# Altium project TH8_Cryo_TC_Breakouts.PrjPCB
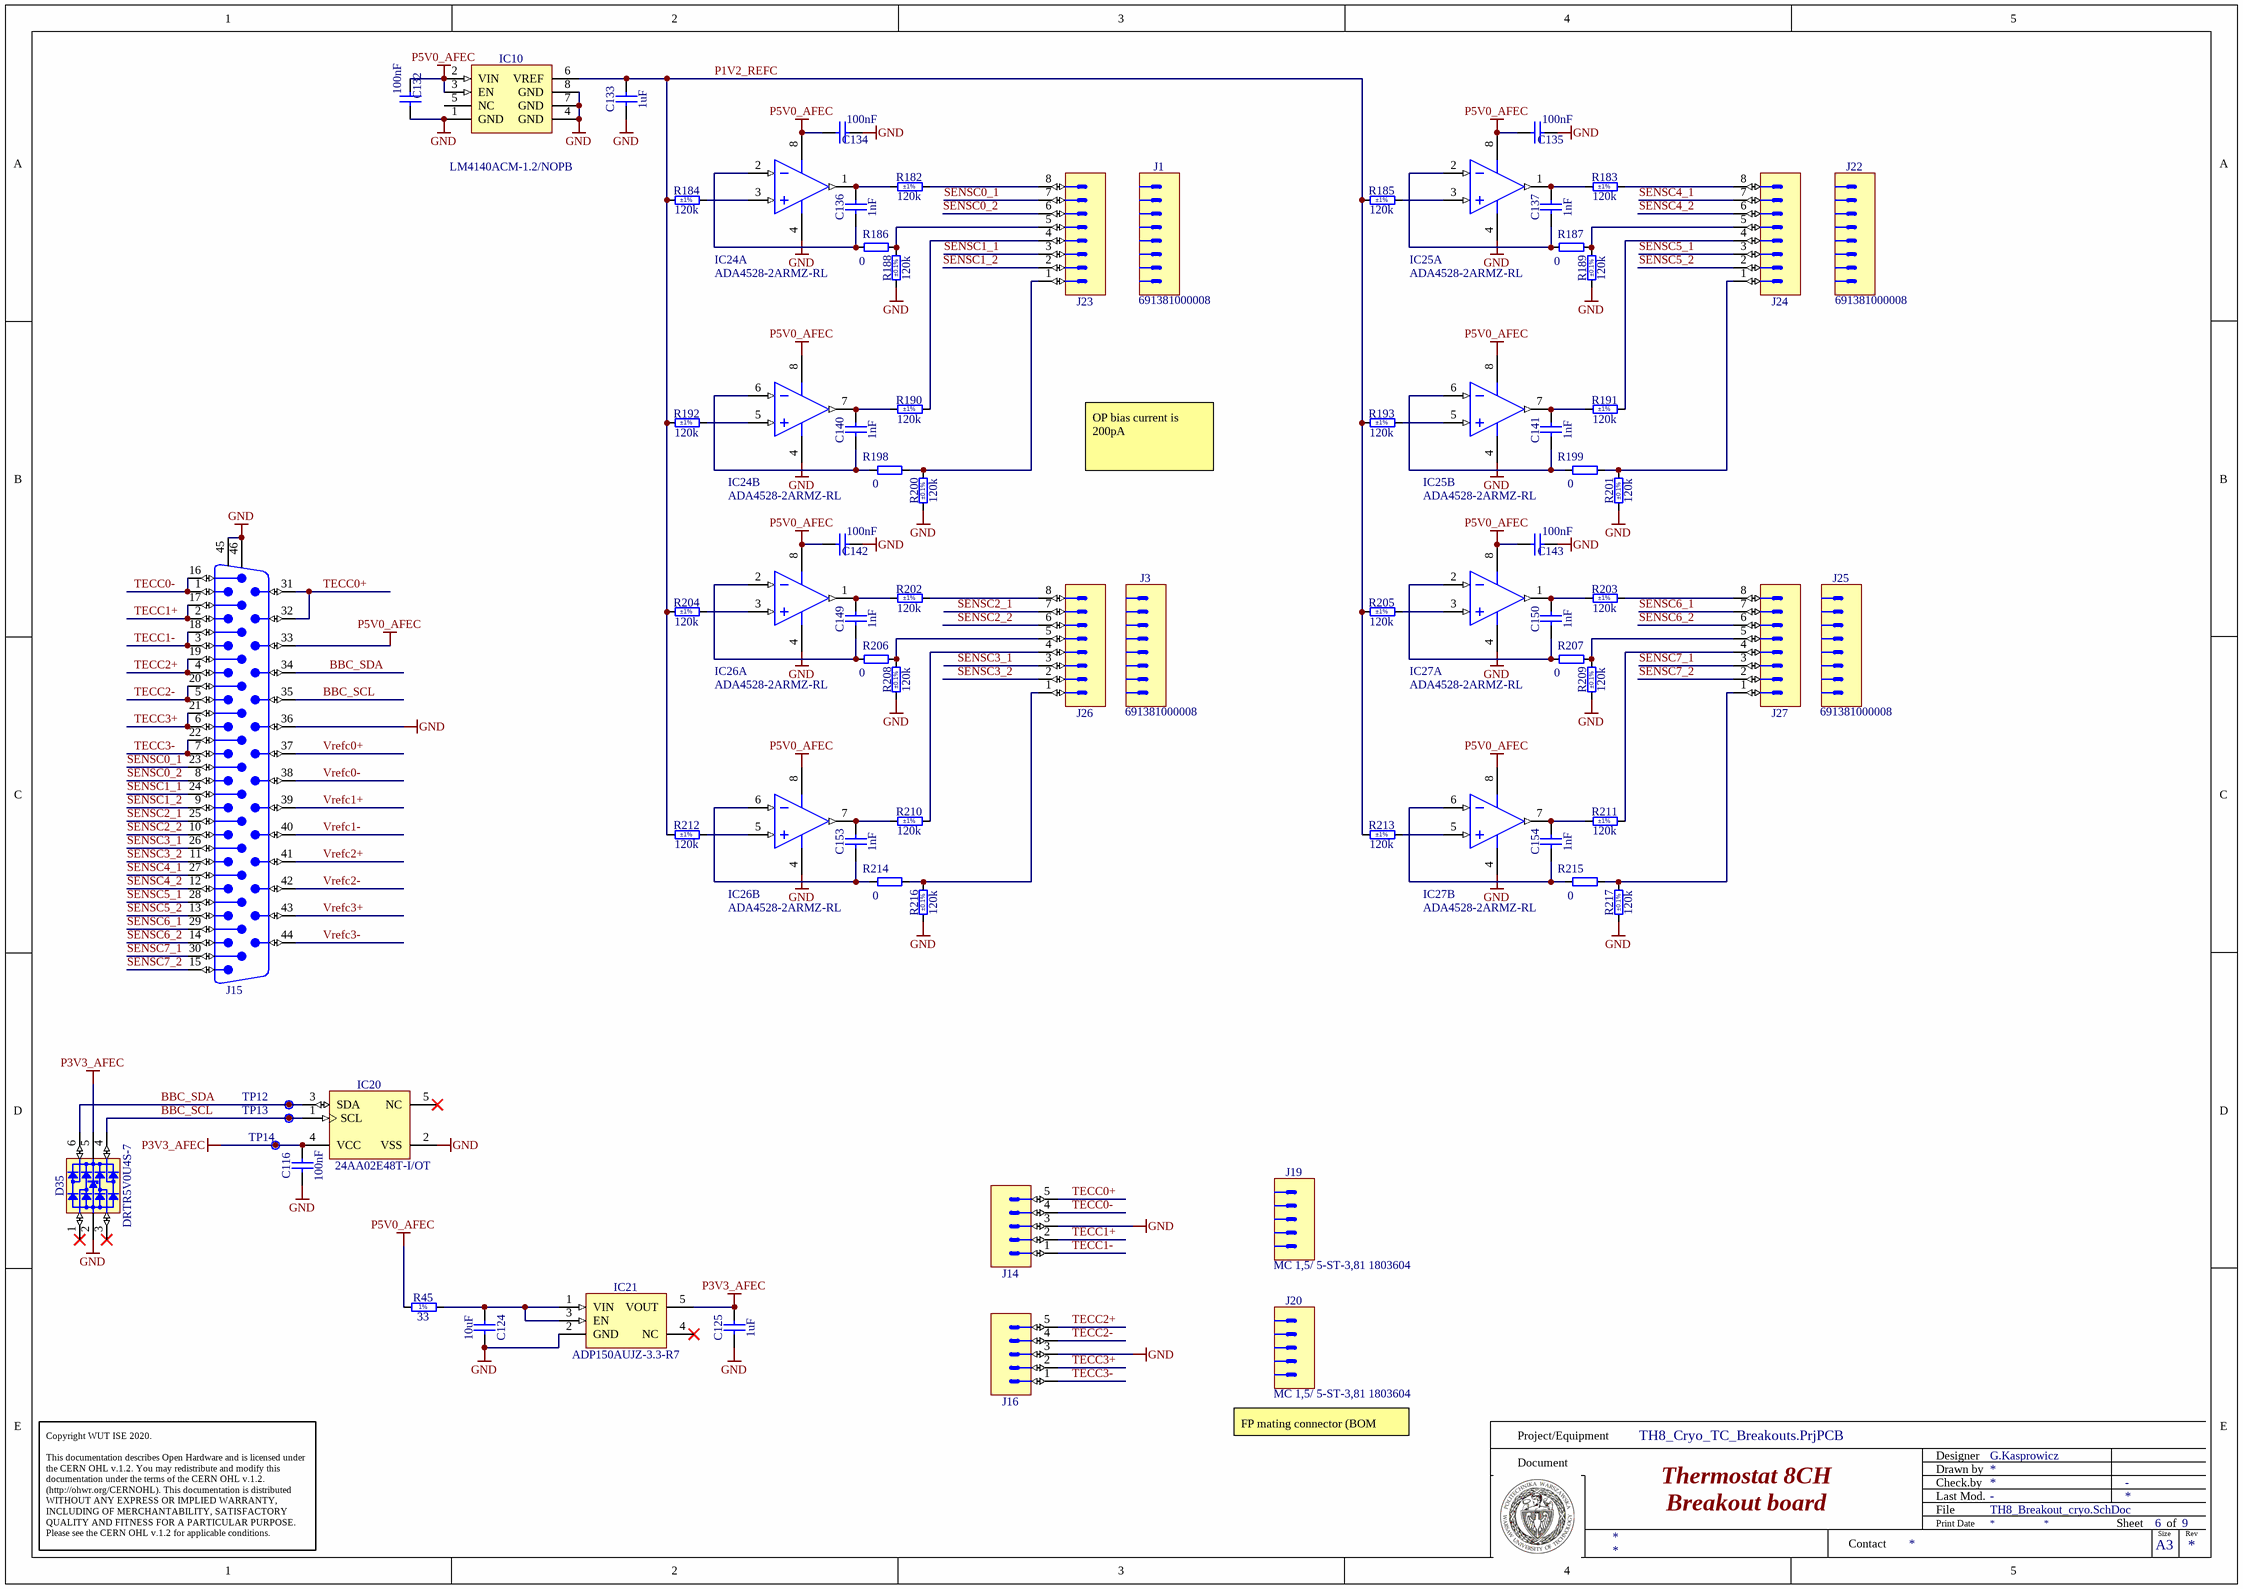
[diagram p0: TH8_Breakout_cryo.SchDoc]
2 sheets, 129 parts. Net scope: global (net labels, ports and power ports of the same name join across sheets).
Board file: TH8_Cryo_TC_Breakouts.PCBDOC
Sheets:
  TH8_Breakout_cryo.SchDoc
  TH8_Breakout.SchDoc

## Sheet TH8_Breakout_cryo.SchDoc: Thermostat 8CH
size 420 x 297 mm; DocumentNumber: 6; SheetNumber: 6; SheetTotal: 9; ModifiedBy: -; CheckedDate: -; Title2: Breakout board; DivGrp: WUT ISE; Designer: G.Kasprowicz

### Parts
C116  100nF  [CAPC1005X55N]
C124  10uF  [CAPC2012X135N]
C125  1uF  [CAPC1608X87N]
C132  100nF  [CAPC1005X55N]
C133  1uF  [CAPC1608X87N]
C134  100nF  [CAPC1005X55N]
C135  100nF  [CAPC1005X55N]
C136  1nF  [CAPC1005X55N]
C137  1nF  [CAPC1005X55N]
C140  1nF  [CAPC1005X55N]
C141  1nF  [CAPC1005X55N]
C142  100nF  [CAPC1005X55N]
C143  100nF  [CAPC1005X55N]
C149  1nF  [CAPC1005X55N]
C150  1nF  [CAPC1005X55N]
C153  1nF  [CAPC1005X55N]
C154  1nF  [CAPC1005X55N]
D35  DRTR5V0U4S-7  [SOT65P210X110-6N]
IC10  LM4140ACM-1.2/NOPB  [SOIC127P600X175-8N]
IC20  24AA02E48T-I/OT  [SOT95P280X145-5N]
IC21  ADP150AUJZ-3.3-R7  [SOT95P280X90-5N]
IC24  ADA4528-2ARMZ-RL  [ADI-RM-8_N]  (parts A,B of 2)
IC25  ADA4528-2ARMZ-RL  [ADI-RM-8_N]  (parts A,B of 2)
IC26  ADA4528-2ARMZ-RL  [ADI-RM-8_N]  (parts A,B of 2)
IC27  ADA4528-2ARMZ-RL  [ADI-RM-8_N]  (parts A,B of 2)
J1  691381000008  [WURTH_691381000008]
J3  691381000008  [WURTH_691381000008]
J14  (no value)  [PHOENIX_1803455]
J15  D-Sub  [AMPHENOL_10090926-P444XLF]  (value not drawn)
J16  (no value)  [PHOENIX_1803455]
J19  Manufacturer Part Number: MC 1,5/ 5-ST-3,81 1803604  [PHOENIX_1803604]
J20  Manufacturer Part Number: MC 1,5/ 5-ST-3,81 1803604  [PHOENIX_1803604]
J22  691381000008  [WURTH_691381000008]
J23  (no value)  [PHOENIX_1881613]
J24  (no value)  [PHOENIX_1881613]
J25  691381000008  [WURTH_691381000008]
J26  (no value)  [PHOENIX_1881613]
J27  (no value)  [PHOENIX_1881613]
R45  33  [RESC1005X40N]
R182  120k  Tolerance: ±1%  [RESC1005X40N]
R183  120k  Tolerance: ±1%  [RESC1005X40N]
R184  120k  Tolerance: ±1%  [RESC1005X40N]
R185  120k  Tolerance: ±1%  [RESC1005X40N]
R186  0  [RESC1608X55N]
R187  0  [RESC1608X55N]
R188  120k  Tolerance: ±0.1%  [RESC2012X60N]
R189  120k  Tolerance: ±0.1%  [RESC2012X60N]
R190  120k  Tolerance: ±1%  [RESC1005X40N]
R191  120k  Tolerance: ±1%  [RESC1005X40N]
R192  120k  Tolerance: ±1%  [RESC1005X40N]
R193  120k  Tolerance: ±1%  [RESC1005X40N]
R198  0  [RESC1608X55N]
R199  0  [RESC1608X55N]
R200  120k  Tolerance: ±0.1%  [RESC2012X60N]
R201  120k  Tolerance: ±0.1%  [RESC2012X60N]
R202  120k  Tolerance: ±1%  [RESC1005X40N]
R203  120k  Tolerance: ±1%  [RESC1005X40N]
R204  120k  Tolerance: ±1%  [RESC1005X40N]
R205  120k  Tolerance: ±1%  [RESC1005X40N]
R206  0  [RESC1608X55N]
R207  0  [RESC1608X55N]
R208  120k  Tolerance: ±0.1%  [RESC2012X60N]
R209  120k  Tolerance: ±0.1%  [RESC2012X60N]
R210  120k  Tolerance: ±1%  [RESC1005X40N]
R211  120k  Tolerance: ±1%  [RESC1005X40N]
R212  120k  Tolerance: ±1%  [RESC1005X40N]
R213  120k  Tolerance: ±1%  [RESC1005X40N]
R214  0  [RESC1608X55N]
R215  0  [RESC1608X55N]
R216  120k  Tolerance: ±0.1%  [RESC2012X60N]
R217  120k  Tolerance: ±0.1%  [RESC2012X60N]
TP12  Test Point  [TPS127]  (value not drawn)
TP13  Test Point  [TPS127]  (value not drawn)
TP14  Test Point  [TPS127]  (value not drawn)

### Nets
GND: C116.1 C124.2 C125.1 C132.2 C133.1 C134.1 C135.1 C142.1 C143.1 D35.2(GND) IC10.1(GND) IC10.4(GND) IC10.7(GND) IC10.8(GND) IC20.2(VSS) IC21.2(GND) IC24.4(-V) IC25.4(-V) IC26.4(-V) IC27.4(-V) J14.3 J15.36 J15.45 J15.46 J16.3 R188.1 R189.1 R200.1 R201.1 R208.1 R209.1 R216.1 R217.1
P3V3_AFEC: C116.2 C125.2 D35.5(VBUS) IC20.4(VCC) IC21.5(VOUT) TP14.1
P5V0_AFEC: C132.1 C134.2 C135.2 C142.2 C143.2 IC10.2(VIN) IC10.3(EN) IC24.8(+V) IC25.8(+V) IC26.8(+V) IC27.8(+V) J15.33 R45.1
BBC_SCL: D35.4(I/O3) IC20.1(SCL) J15.35 TP13.1
BBC_SDA: D35.6(I/O4) IC20.3(SDA) J15.34 TP12.1
P1V2_REFC: C133.2 IC10.6(VREF) R184.1 R185.1 R192.1 R193.1 R204.1 R205.1 R212.1 R213.1
SENSC0_1: J15.23 J23.7
SENSC0_2: J15.8 J23.6
SENSC1_1: J15.24 J23.3
SENSC1_2: J15.9 J23.2
SENSC2_1: J15.25 J26.7
SENSC2_2: J15.10 J26.6
SENSC3_1: J15.26 J26.3
SENSC3_2: J15.11 J26.2
SENSC4_1: J15.27 J24.7
SENSC4_2: J15.12 J24.6
SENSC5_1: J15.28 J24.3
SENSC5_2: J15.13 J24.2
SENSC6_1: J15.29 J27.7
SENSC6_2: J15.14 J27.6
SENSC7_1: J15.30 J27.3
SENSC7_2: J15.15 J27.2
TECC0+: J14.5 J15.31 J15.32
TECC0-: J14.4 J15.1 J15.16
TECC1+: J14.2 J15.2 J15.17
TECC1-: J14.1 J15.3 J15.18
TECC2+: J15.4 J15.19 J16.5
TECC2-: J15.5 J15.20 J16.4
TECC3+: J15.6 J15.21 J16.2
TECC3-: J15.7 J15.22 J16.1
Vrefc0+: J15.37
Vrefc0-: J15.38
Vrefc1+: J15.39
Vrefc1-: J15.40
Vrefc2+: J15.41
Vrefc2-: J15.42
Vrefc3+: J15.43
Vrefc3-: J15.44
NetC124_1: C124.1 IC21.1(VIN) IC21.3(EN) R45.2
NetC136_1: C136.1 IC24.2(-IN_A) R186.2
NetC136_2: C136.2 IC24.1(OUT_A) R182.1
NetC137_1: C137.1 IC25.2(-IN_A) R187.2
NetC137_2: C137.2 IC25.1(OUT_A) R183.1
NetC140_1: C140.1 IC24.6(-IN_B) R198.2
NetC140_2: C140.2 IC24.7(OUT_B) R190.1
NetC141_1: C141.1 IC25.6(-IN_B) R199.2
NetC141_2: C141.2 IC25.7(OUT_B) R191.1
NetC149_1: C149.1 IC26.2(-IN_A) R206.2
NetC149_2: C149.2 IC26.1(OUT_A) R202.1
NetC150_1: C150.1 IC27.2(-IN_A) R207.2
NetC150_2: C150.2 IC27.1(OUT_A) R203.1
NetC153_1: C153.1 IC26.6(-IN_B) R214.2
NetC153_2: C153.2 IC26.7(OUT_B) R210.1
NetC154_1: C154.1 IC27.6(-IN_B) R215.2
NetC154_2: C154.2 IC27.7(OUT_B) R211.1
NetIC24_3: IC24.3(+IN_A) R184.2
NetIC24_5: IC24.5(+IN_B) R192.2
NetIC25_3: IC25.3(+IN_A) R185.2
NetIC25_5: IC25.5(+IN_B) R193.2
NetIC26_3: IC26.3(+IN_A) R204.2
NetIC26_5: IC26.5(+IN_B) R212.2
NetIC27_3: IC27.3(+IN_A) R205.2
NetIC27_5: IC27.5(+IN_B) R213.2
NetJ23_1: J23.1 R198.1 R200.2
NetJ23_4: J23.4 R190.2
NetJ23_5: J23.5 R186.1 R188.2
NetJ23_8: J23.8 R182.2
NetJ24_1: J24.1 R199.1 R201.2
NetJ24_4: J24.4 R191.2
NetJ24_5: J24.5 R187.1 R189.2
NetJ24_8: J24.8 R183.2
NetJ26_1: J26.1 R214.1 R216.2
NetJ26_4: J26.4 R210.2
NetJ26_5: J26.5 R206.1 R208.2
NetJ26_8: J26.8 R202.2
NetJ27_1: J27.1 R215.1 R217.2
NetJ27_4: J27.4 R211.2
NetJ27_5: J27.5 R207.1 R209.2
NetJ27_8: J27.8 R203.2

Not connected (* = marked no-connect by the designer): D35 1(I/O1)* 3(I/O2)*; IC10 5(NC); IC20 5(NC)*; IC21 4(NC)*

### Notes on the sheet
- OP bias current is 200pA
- FP mating connector (BOM only)
- Project/Equipment
- Document
- Designer
- Drawn by
- Check.by
- Copyright WUT ISE 2020.
  This documentation describes Open Hardware and is licensed under the CERN OHL v.1.2. You may redistribute and modify this documentation under the terms of the CERN OHL v.1.2. (http://ohwr.org/CERNOHL). This documentation is distributed WITHOUT ANY EXPRESS OR IMPLIED WARRANTY, INCLUDING OF MERCHANTABILITY, SATISFACTORY QUALITY AND FITNESS FOR A PARTICULAR PURPOSE. Please see the CERN OHL v.1.2 for applicable conditions.
- Contact
- File
- Last Mod.
- Print Date
- Sheet
- Size
- A3
- of
- Rev
- (in symbol R0402_33R_1%_0.0625W_100PPM) 1%

### Library data of the parts
C116 C132 C134 C135 C142 C143 = CC0402_100NF_16V_10%_X5R: Non-polarised capacitor; Part Description: SMD Multilayer Chip Ceramic Capacitor; Manufacturer: GENERIC; Manufacturer1 Part Number: GRM155R61C104KA88D; Voltage: 16V; TC: X5R; Tolerance: ±10%; Part Number: CC0402_100NF_16V_10%_X5R; Component Kind: Standard; Component Type: Standard; Pin Count: 2; Value: 100nF; Status: None; Manufacturer Part Number: CC0402_100NF_16V_10%_X5R; Case: 0402; Mounted: Yes; Socket: No; SMD: Yes; Sense: No; Manufacturer1 Example: MURATA; Manufacturer1 ComponentHeight: 0.55mm; HelpURL: \\cern.ch\dfs\Applications\Altium\Datasheets\CC0402_X5R_MURATA_GRM.pdf; Author: CERN DEM JLC; CreateDate: 10.12.2013; LatestRevisionDate: 10.12.2013
C124 = CC0805_10UF_16V_10%_X5R: Non-polarised capacitor; Part Description: SMD Multilayer Chip Ceramic Capacitor; Manufacturer: GENERIC; Manufacturer1 Part Number: C0805C106K4PAC; Voltage: 16V; TC: X5R; Tolerance: ±10%; Part Number: CC0805_10UF_16V_10%_X5R; Component Kind: Standard; Component Type: Standard; Pin Count: 2; Value: 10uF; Status: Preferred; Manufacturer Part Number: CC0805_10UF_16V_10%_X5R; Case: 0805; Mounted: Yes; Socket: No; SMD: Yes; Manufacturer1 Example: KEMET; Manufacturer1 ComponentHeight: 1.4mm; HelpURL: \\cern.ch\dfs\Applications\Altium\Datasheets\CC1206_X5R_KEMET.pdf; Author: CERN DEM JLC; CreateDate: 03.12.2007; LatestRevisionDate: 03.12.2007; Sense: No
C125 C133 = CC0603_1UF_25V_10%_X7R: Non-polarised capacitor; Part Description: SMD Multilayer Chip Ceramic Capacitor; Manufacturer: GENERIC; Manufacturer1 Part Number: GRM188R71E105KA12D; Voltage: 25V; TC: X7R; Tolerance: ±10%; Part Number: CC0603_1UF_25V_10%_X7R; Component Kind: Standard; Component Type: Standard; Pin Count: 2; Value: 1uF; Status: None; Manufacturer Part Number: CC0603_1UF_25V_10%_X7R; Case: 0603; Mounted: Yes; Socket: No; SMD: Yes; Sense: No; Manufacturer1 Example: MURATA; Manufacturer1 ComponentHeight: 0.9mm; HelpURL: \\cern.ch\dfs\Applications\Altium\Datasheets\CC0603_X7R_MURATA.pdf; Author: CERN DEM JLC; CreateDate: 18/01/2011; LatestRevisionDate: 18/01/2011
C136 C137 C140 C141 C149 C150 C153 C154 = CC0402_1NF_50V_10%_X7R: Non-polarised capacitor; Part Description: SMD Multilayer Chip Ceramic Capacitor; Manufacturer: GENERIC; Manufacturer1 Part Number: 223858715623; Voltage: 50V; TC: X7R; Tolerance: ±10%; Part Number: CC0402_1NF_50V_10%_X7R; Component Kind: Standard; Component Type: Standard; Pin Count: 2; Value: 1nF; Status: Not Recommended; Manufacturer Part Number: CC0402_1NF_50V_10%_X7R; Case: 0402; Mounted: Yes; Socket: No; SMD: Yes; Sense: No; Manufacturer1 Example: PHYCOMP; Manufacturer1 ComponentHeight: 0.55mm; HelpURL: \\cern.ch\dfs\Applications\Altium\Datasheets\CC0402_X7R_PHYCOMP.pdf; Author: CERN DEM JLC; CreateDate: 03/12/2007; LatestRevisionDate: 03/12/2007
D35 = D_TVS_DRTR5V0U4S-7: Integrated Quad Ultra-Low Capacitance ESD Protection; Part Description: Integrated Quad Ultra-Low Capacitance ESD (±8kV) Protection; Manufacturer: DIODES; PressFit: No; Bonding: No; Status Comment: Active; Part Number: DRTR5V0U4S-7; Component Kind: Standard; Component Type: Standard; Device: DRTR5V0U4S-7; PackageDescription: SOT363, SC70-6, 0.65mm Pitch; 6 Pin, 1.25mm W X 2.00mm L X 1.10mm H body, IPC Medium Density; Status: Active; Manufacturer Part Number: DRTR5V0U4S-7; Pin Count: 6; Case: SOT363; Mounted: Yes; Socket: No; SMD: Yes; Sense: No; ComponentHeight: 1.1mm; HelpURL: \\cern.ch\dfs\Applications\Altium\Datasheets\PRTR5V0U4Y.pdf; Author: GK; CreateDate: 24.01.2017; LatestRevisionDate: 14.09.2020
IC10 = LM4140ACM-1.2/NOPB: High Precision Low Noise Low Dropout Voltage Reference; Part Description: 1.2V 0.1% 3 ppm/°C, High Precision Low Noise Low Dropout Voltage Reference; Manufacturer: TEXAS INSTRUMENTS; PressFit: No; Bonding: No; Part Number: LM4140ACM-1.2/NOPB; Component Kind: Standard; Component Type: Standard; Device: LM4140ACM-1.2/NOPB; PackageDescription: SOIC 8, Pitch 1.27mm, Body 4x5mm, IPC Medium Density; Manufacturer Part Number: LM4140ACM-1.2/NOPB; Pin Count: 8; Case: SOIC8; Mounted: Yes; Socket: No; SMD: Yes; Sense: No; ComponentHeight: 1.75mm; HelpURL: \\cern.ch\dfs\Applications\Altium\Datasheets\LM4140ACM-1.2-NOPB.pdf; Author: CERN DEM JLC; CreateDate: 17.11.2014; LatestRevisionDate: 17.11.2014
IC20 = 24AA02E48T-I/OT: 1.7V-5.5V, 2K I2C Serial EEPROM With EUI-48 Node Identity; Manufacturer: MICROCHIP TECHNOLOGY; PressFit: No; Bonding: No; Part Number: 24AA02E48T-I/OT; Component Kind: Standard; Component Type: Standard; Device: 24AA02E48T-I/OT; PackageDescription: SOT, 0.95mm pitch; 5 pin, 1.60mm W X 2.90mm L X 1.45mm H body, IPC Medium Density; Part Description: 1.7V-5.5V, 2K I2C Serial EEPROM With EUI-48 Node Identity; Manufacturer Part Number: 24AA02E48T-I/OT; Pin Count: 5; Case: SOT23-5; Mounted: Yes; Socket: No; SMD: Yes; Sense: No; ComponentHeight: 1.45mm; HelpURL: \\cern.ch\dfs\Applications\Altium\Datasheets\24AA02E48T-I-OT.pdf; Author: CERN DEM MR; CreateDate: 31.03.2016; LatestRevisionDate: 31.03.2016
IC21 = ADP150AUJZ-3.3-R7: Ultralow Noise, 150 mA CMOS Linear Regulator; Part Description: 3.3V, 150mA, Ultralow Noise, CMOS Linear Regulator; Manufacturer: ANALOG DEVICES; PressFit: No; Bonding: No; Part Number: ADP150AUJZ-3.3-R7; Component Kind: Standard; Component Type: Standard; Device: ADP150AUJZ-3.3-R7; PackageDescription: SOT23, 0.95mm pitch; 5 pin, 1.75mm W X 3.00mm L, IPC Medium Density; Manufacturer Part Number: ADP150AUJZ-3.3-R7; Pin Count: 5; Case: SOT23; Mounted: Yes; Socket: No; SMD: Yes; Sense: No; ComponentHeight: 0.9mm; HelpURL: \\cern.ch\dfs\Applications\Altium\Datasheets\ADP150AUJZ-3.3-R7.pdf; Author: CERN DEM JLC; CreateDate: 27/09/2011; LatestRevisionDate: 19/06/2014
IC24-IC27 = CMP-0384-01794-1: Double Channel RRIO Operational Amplifier, 3.4 MHz BW, 500 mV/us SR, Industrial, 8-pin SOP (RM-8), Reel; Manufacturer: Analog Devices; V Span Max: 5.5V; Iq/Amp: 1.5mA; Amplifiers Per Package: 2; Input Bias Current: 125pA; V Span Min: 2.2V; Small Signal Bandwidth: 3.4MHz; Input Offset Voltage: 300nV; Code_JEDEC: MO-187-AA; PackageReference: RM-8; ComponentLink3Description: Package Specification; Slew Rate: 500mV/us; PartNumber: ADA4528-2ARMZ-RL; ComponentLink2Description: Datasheet; Generic Part Number: ADA4528-2; DatasheetVersion: Rev. C; ComponentLink1URL: http://www.analog.com/en/index.html; Packing: Reel; ComponentLink3URL: http://www.analog.com/static/imported-files/packages/PKG_PDF/MSOP%28RM%29/RM_8.pdf; PackageDescription: 8-Pin Mini Small Outline Package, Body 3 x 3 mm, Pitch 0.65 mm; ComponentLink2URL: http://www.analog.com/static/imported-files/data_sheets/ADA4528-1_4528-2.pdf; ComponentLink1Description: Manufacturer URL; Mounting Technology: Surface Mount
J1 J3 J22 J25 = CON_TB_WURTH_691381000008: Phoenix Contact 2.5 pitch terminal plug, 8 ways; Manufacturer: WURTH; Manufacturer Part Number: 691381000008
J14 J16 = PHOENIX_1803455: Connector 5 Male; Part Description: 8A 160 V, Pitch: 3.81mm, 5 Positions Header; Manufacturer: PHOENIX CONTACT; Manufacturer Part Number: 1803455 (MCV 1,5/ 5-G-3,81); PressFit: No; Part Number: PHOENIX_1803455; Component Kind: Standard; Component Type: Standard; Pin Count: 5; Mounted: Yes; Socket: No; SMD: No; Sense: No; Status: None; ComponentHeight: 9.2mm; HelpURL: \\cern.ch\dfs\Applications\Altium\Datasheets\PHOENIX_1803455.pdf; Author: CERN DEM JLC; CreateDate: 04.11.2013; LatestRevisionDate: 04.11.2013
J15 = AMPHENOL_10090926-P444XLF: Connector D-sub 44 Male; Part Description: Right Angle High Density D-sub 44 Male Contacts with Harpoons + UNC 4-40 Clinchnuts + Electrical Continuity; PressFit: No; Part Number: AMPHENOL_10090926-P444XLF; Component Kind: Standard; Component Type: Standard; Pin Count: 46; Family: D-Sub; Mounted: Yes; Socket: No; SMD: No; Sense: No; Status: None; Manufacturer: AMPHENOL; Manufacturer Part Number: 10090926-P444XLF; ComponentHeight: 12.8mm; HelpURL: \\cern.ch\dfs\Applications\Altium\Datasheets\AMPHENOL_10090926-P444XLF.pdf; Author: CERN DEM BC; CreateDate: 22.10.2020; LatestRevisionDate: 22.10.2020
J19 J20 = PHOENIX_1803604: Phoenix Contact 3.81 pitch terminal plug, 5 ways; Mates with: PHOENIX_1803303; Manufacturer: Phoenix Contact
J23 J24 J26 J27 = PHOENIX_1881613: Connector 8 Male; Part Description: 4A, 160V, MICRO COMBICON PCB Header, Pitch 2.5mm, 8 Positions; Manufacturer: PHOENIX CONTACT; Manufacturer Part Number: 1881613 (MCV 0,5/ 8-G-2,5); PressFit: No; Part Number: PHOENIX_1881613; Component Kind: Standard; Component Type: Standard; Pin Count: 8; Mounted: Yes; Socket: No; SMD: No; Sense: No; Status: None; ComponentHeight: 10.1mm; HelpURL: \\cern.ch\dfs\Applications\Altium\Datasheets\PHOENIX_1881613.pdf; Author: CERN DEM JLC; CreateDate: 03.11.2009; LatestRevisionDate: 10.02.2011
R45 = R0402_33R_1%_0.0625W_100PPM: Resistor - 1%; Part Description: General Purpose Thick Film Chip Resistor; Manufacturer: GENERIC; Manufacturer1 Part Number: 232270673309L; TC: ±100ppm/°C; PressFit: No; Part Number: R0402_33R_1%_0.0625W_100PPM; Component Kind: Standard; Component Type: Standard; Pin Count: 2; Value: 33; Status: Not Recommended; Power: 0.0625W; Tolerance: ±1%; Manufacturer Part Number: R0402_33R_1%_0.0625W_100PPM; Case: 0402; Mounted: Yes; Sense: No; Socket: No; SMD: Yes; Manufacturer1 Example: YAGEO PHYCOMP; Manufacturer1 ComponentHeight: 0.4mm; HelpURL: \\cern.ch\dfs\Applications\Altium\Datasheets\R0402_Phycomp_RC0402.pdf; Author: CERN DEM JLC; CreateDate: 03/12/2007; LatestRevisionDate: 17/10/2012
R182-R185 R190-R193 R202-R205 R210-R213 = R0402_120K_1%_0.0625W_100PPM: Resistor - 1%; Part Description: General Purpose Thick Film Chip Resistor; Manufacturer: GENERIC; Manufacturer1 Part Number: 232270671204L; TC: ±100ppm/°C; PressFit: No; Part Number: R0402_120K_1%_0.0625W_100PPM; Component Kind: Standard; Component Type: Standard; Pin Count: 2; Value: 120k; Status: Not Recommended; Power: 0.0625W; Manufacturer Part Number: R0402_120K_1%_0.0625W_100PPM; Case: 0402; Mounted: Yes; Sense: No; Socket: No; SMD: Yes; Manufacturer1 Example: YAGEO PHYCOMP; Manufacturer1 ComponentHeight: 0.4mm; HelpURL: \\cern.ch\dfs\Applications\Altium\Datasheets\R0402_Phycomp_RC0402.pdf; Author: CERN DEM JLC; CreateDate: 03.12.2007; LatestRevisionDate: 17.10.2012
R186 R187 R198 R199 R206 R207 R214 R215 = R0603_0R_JUMPER: Resistor; Part Description: 1A (0.05R Max DC Resistance) Zero Ohm Jumper; Manufacturer: GENERIC; Manufacturer1 Part Number: NRC06Z0; PressFit: No; Part Number: R0603_0R_JUMPER; Component Kind: Standard; Component Type: Standard; Pin Count: 2; Value: 0; Status: Preferred; Manufacturer Part Number: R0603_0R_JUMPER; Case: 0603; Mounted: Yes; Sense: No; Socket: No; SMD: Yes; Manufacturer1 Example: NIC COMPONENT; Manufacturer1 ComponentHeight: 0.55mm; HelpURL: \\cern.ch\dfs\Applications\Altium\Datasheets\R0603_NIC_NRC.pdf; Author: CERN DEM JLC; CreateDate: 03.12.2007; LatestRevisionDate: 13.03.2008
R188 R189 R200 R201 R208 R209 R216 R217 = R0805_120K_0.1%_0.125W_25PPM: Resistor - 0.1%; Part Description: Thin Film Chip Resistor; Manufacturer: GENERIC; Manufacturer1 Part Number: ERA6AEB124V; Power: 0.125W; TC: ±25ppm; PressFit: No; Part Number: R0805_120K_0.1%_0.125W_25PPM; Component Kind: Standard; Component Type: Standard; Pin Count: 2; Value: 120k; Status: Not Recommended; Manufacturer Part Number: R0805_120K_0.1%_0.125W_25PPM; Case: 0805; Mounted: Yes; Sense: No; Socket: No; SMD: Yes; Manufacturer1 Example: PANASONIC; Manufacturer1 ComponentHeight: 0.6mm; HelpURL: \\cern.ch\dfs\Applications\Altium\Datasheets\R0805_PANASONIC_ERA.pdf; Author: CERN DEM JLC; CreateDate: 04.06.2015; LatestRevisionDate: 04.06.2015
TP12-TP14 = SMD_PAD_1.27X1.27MM: Part Description: 1.27mm x 1.27mm PCB Copper Area (SMD Test Point); Mounted: No; Part Number: SMD_PAD_1.27X1.27MM; Component Kind: Standard (No BOM); Component Type: Standard (No BOM); Pin Count: 1; Family: Test Point; Socket: No; SMD: Yes; Sense: No; Status: None; ComponentHeight: 0mm; HelpURL: Undefined; Author: CERN DEM JLC; CreateDate: 12.01.2008; LatestRevisionDate: 12.01.2008; PackageDescription: 1.27mm x 1.27mm PCB Copper Area (SMD Test Point)

## Sheet TH8_Breakout.SchDoc: Thermostat 8CH
size 420 x 297 mm; DocumentNumber: 6; SheetNumber: 6; SheetTotal: 9; ModifiedBy: -; CheckedDate: -; Title2: Breakout board; DivGrp: WUT ISE; Designer: G.Kasprowicz
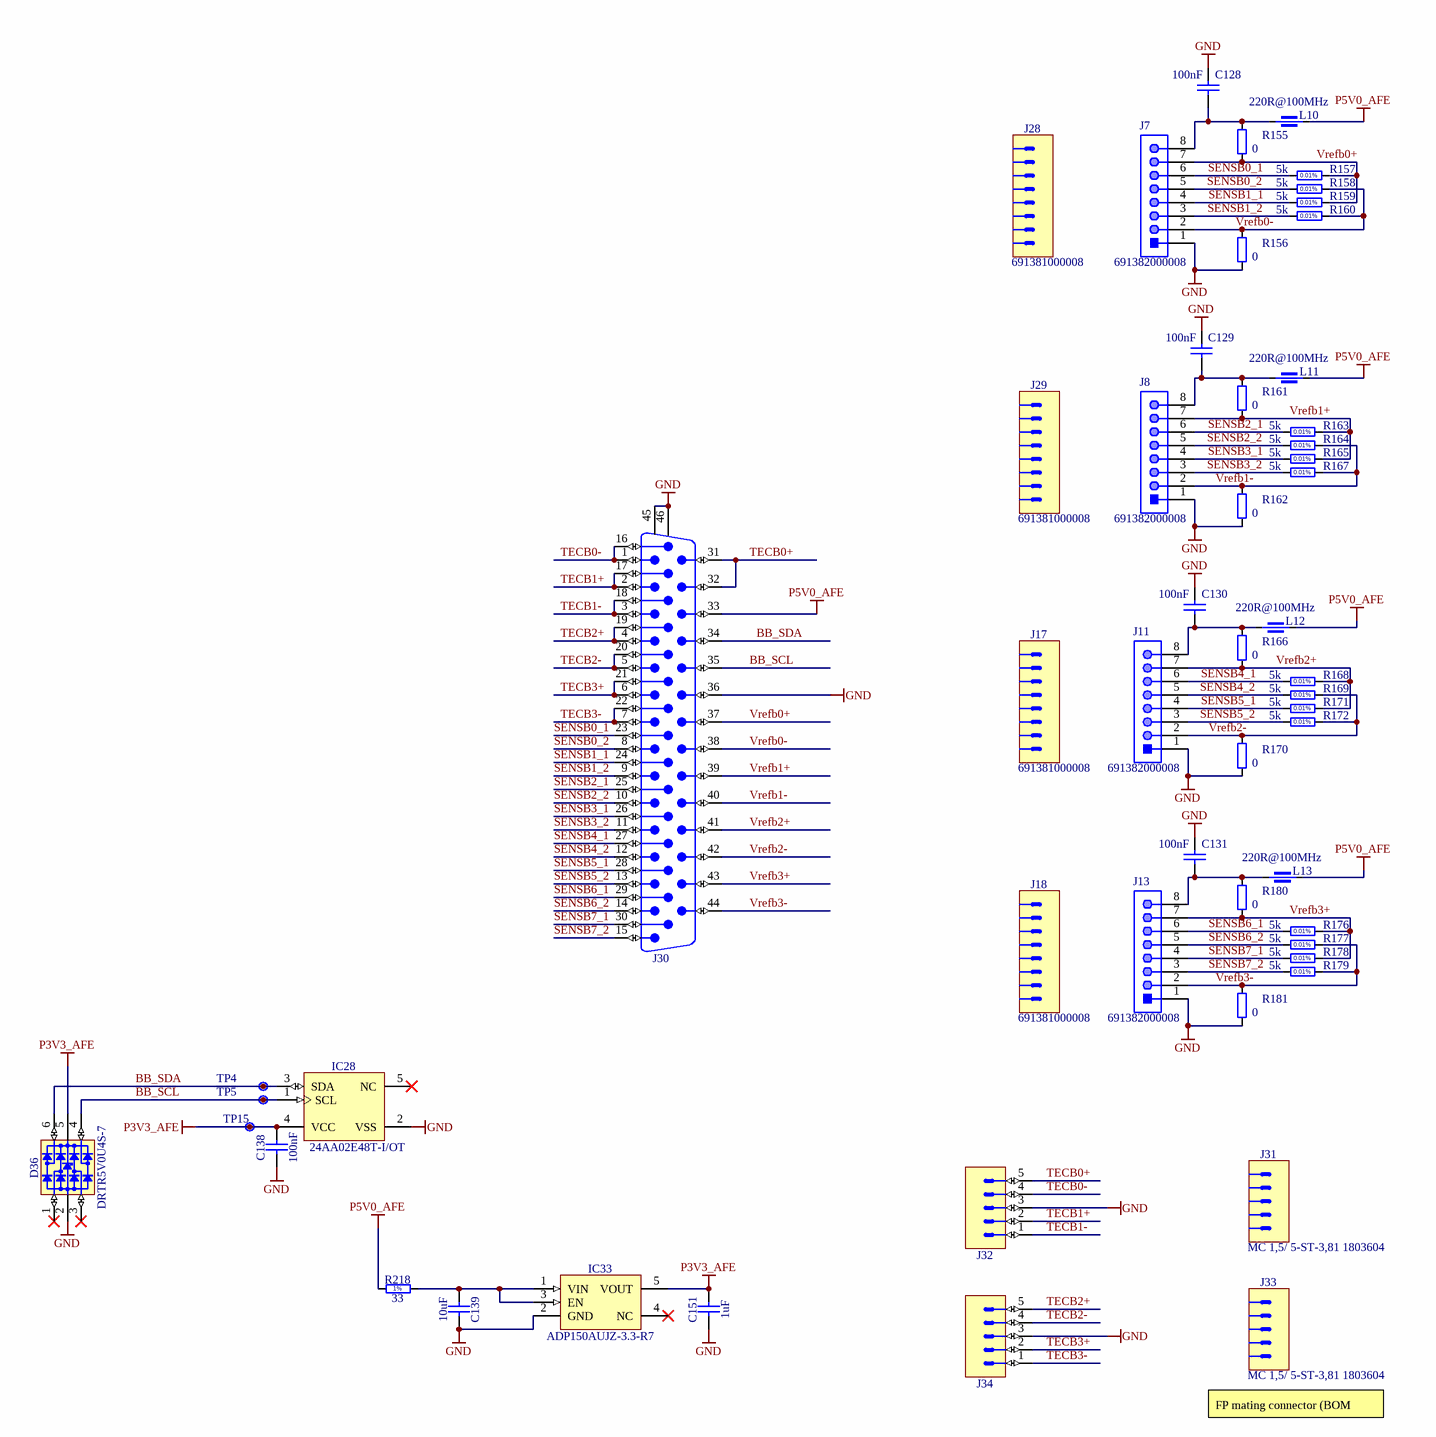
[diagram p1: TH8_Breakout.SchDoc]

### Parts
C128  100nF  [CAPC1005X55N]
C129  100nF  [CAPC1005X55N]
C130  100nF  [CAPC1005X55N]
C131  100nF  [CAPC1005X55N]
C138  100nF  [CAPC1005X55N]
C139  10uF  [CAPC2012X135N]
C151  1uF  [CAPC1608X87N]
D36  DRTR5V0U4S-7  [SOT65P210X110-6N]
IC28  24AA02E48T-I/OT  [SOT95P280X145-5N]
IC33  ADP150AUJZ-3.3-R7  [SOT95P280X90-5N]
J7  691382000008  [691382000008]
J8  691382000008  [691382000008]
J11  691382000008  [691382000008]
J13  691382000008  [691382000008]
J17  691381000008  [WURTH_691381000008]
J18  691381000008  [WURTH_691381000008]
J28  691381000008  [WURTH_691381000008]
J29  691381000008  [WURTH_691381000008]
J30  D-Sub  [AMPHENOL_10090926-P444XLF]  (value not drawn)
J31  Manufacturer Part Number: MC 1,5/ 5-ST-3,81 1803604  [PHOENIX_1803604]
J32  (no value)  [PHOENIX_1803455]
J33  Manufacturer Part Number: MC 1,5/ 5-ST-3,81 1803604  [PHOENIX_1803604]
J34  (no value)  [PHOENIX_1803455]
L10  220R@100MHz  [INDC1005X55N]
L11  220R@100MHz  [INDC1005X55N]
L12  220R@100MHz  [INDC1005X55N]
L13  220R@100MHz  [INDC1005X55N]
R155  0  [RESC1608X55N]
R156  0  [RESC1608X55N]
R157  5k  [RESC2013X64N]
R158  5k  [RESC2013X64N]
R159  5k  [RESC2013X64N]
R160  5k  [RESC2013X64N]
R161  0  [RESC1608X55N]
R162  0  [RESC1608X55N]
R163  5k  [RESC2013X64N]
R164  5k  [RESC2013X64N]
R165  5k  [RESC2013X64N]
R166  0  [RESC1608X55N]
R167  5k  [RESC2013X64N]
R168  5k  [RESC2013X64N]
R169  5k  [RESC2013X64N]
R170  0  [RESC1608X55N]
R171  5k  [RESC2013X64N]
R172  5k  [RESC2013X64N]
R176  5k  [RESC2013X64N]
R177  5k  [RESC2013X64N]
R178  5k  [RESC2013X64N]
R179  5k  [RESC2013X64N]
R180  0  [RESC1608X55N]
R181  0  [RESC1608X55N]
R218  33  [RESC1005X40N]
TP4  Test Point  [TPS127]  (value not drawn)
TP5  Test Point  [TPS127]  (value not drawn)
TP15  Test Point  [TPS127]  (value not drawn)

### Nets
GND: C128.1 C129.1 C130.1 C131.1 C138.1 C139.2 C151.1 D36.2(GND) IC28.2(VSS) IC33.2(GND) J7.1 J8.1 J11.1 J13.1 J30.36 J30.45 J30.46 J32.3 J34.3 R156.1 R162.1 R170.1 R181.1
P3V3_AFE: C138.2 C151.2 D36.5(VBUS) IC28.4(VCC) IC33.5(VOUT) TP15.1
P5V0_AFE: J30.33 L10.2 L11.2 L12.2 L13.2 R218.1
BB_SCL: D36.4(I/O3) IC28.1(SCL) J30.35 TP5.1
BB_SDA: D36.6(I/O4) IC28.3(SDA) J30.34 TP4.1
SENSB0_1: J7.6 J30.23 R157.1
SENSB0_2: J7.5 J30.8 R158.1
SENSB1_1: J7.4 J30.24 R159.1
SENSB1_2: J7.3 J30.9 R160.1
SENSB2_1: J8.6 J30.25 R163.1
SENSB2_2: J8.5 J30.10 R164.1
SENSB3_1: J8.4 J30.26 R165.1
SENSB3_2: J8.3 J30.11 R167.1
SENSB4_1: J11.6 J30.27 R168.1
SENSB4_2: J11.5 J30.12 R169.1
SENSB5_1: J11.4 J30.28 R171.1
SENSB5_2: J11.3 J30.13 R172.1
SENSB6_1: J13.6 J30.29 R176.1
SENSB6_2: J13.5 J30.14 R177.1
SENSB7_1: J13.4 J30.30 R178.1
SENSB7_2: J13.3 J30.15 R179.1
TECB0+: J30.31 J30.32 J32.5
TECB0-: J30.1 J30.16 J32.4
TECB1+: J30.2 J30.17 J32.2
TECB1-: J30.3 J30.18 J32.1
TECB2+: J30.4 J30.19 J34.5
TECB2-: J30.5 J30.20 J34.4
TECB3+: J30.6 J30.21 J34.2
TECB3-: J30.7 J30.22 J34.1
Vrefb0+: J7.7 J30.37 R155.1 R157.2 R159.2
Vrefb0-: J7.2 J30.38 R156.2 R158.2 R160.2
Vrefb1+: J8.7 J30.39 R161.1 R163.2 R165.2
Vrefb1-: J8.2 J30.40 R162.2 R164.2 R167.2
Vrefb2+: J11.7 J30.41 R166.1 R168.2 R171.2
Vrefb2-: J11.2 J30.42 R169.2 R170.2 R172.2
Vrefb3+: J13.7 J30.43 R176.2 R178.2 R180.1
Vrefb3-: J13.2 J30.44 R177.2 R179.2 R181.2
NetC128_2: C128.2 J7.8 L10.1 R155.2
NetC129_2: C129.2 J8.8 L11.1 R161.2
NetC130_2: C130.2 J11.8 L12.1 R166.2
NetC131_2: C131.2 J13.8 L13.1 R180.2
NetC139_1: C139.1 IC33.1(VIN) IC33.3(EN) R218.2

Not connected (* = marked no-connect by the designer): D36 1(I/O1)* 3(I/O2)*; IC28 5(NC)*; IC33 4(NC)*

### Notes on the sheet
- FP mating connector (BOM only)
- Project/Equipment
- Document
- Designer
- Drawn by
- Check.by
- Copyright WUT ISE 2020.
  This documentation describes Open Hardware and is licensed under the CERN OHL v.1.2. You may redistribute and modify this documentation under the terms of the CERN OHL v.1.2. (http://ohwr.org/CERNOHL). This documentation is distributed WITHOUT ANY EXPRESS OR IMPLIED WARRANTY, INCLUDING OF MERCHANTABILITY, SATISFACTORY QUALITY AND FITNESS FOR A PARTICULAR PURPOSE. Please see the CERN OHL v.1.2 for applicable conditions.
- Contact
- File
- Last Mod.
- Print Date
- Sheet
- Size
- A3
- of
- Rev
- (in symbol R0402_33R_1%_0.0625W_100PPM) 1%
- (in symbol R0805_5K_0.01%_0.2W_0.2PPM_VISHAY_VSMP) 0.01%

### Library data of the parts
C128-C131 C138 = CC0402_100NF_16V_10%_X5R: as C116 on sheet TH8_Breakout_cryo; Part Number: CC0402_100NF_16V_10%_X5R; Component Kind: Standard; Component Type: Standard; Pin Count: 2; Value: 100nF; Status: None; Manufacturer Part Number: CC0402_100NF_16V_10%_X5R; Case: 0402; Mounted: Yes; Socket: No; SMD: Yes; Sense: No; Manufacturer1 Example: MURATA; Manufacturer1 ComponentHeight: 0.55mm; HelpURL: \\cern.ch\dfs\Applications\Altium\Datasheets\CC0402_X5R_MURATA_GRM.pdf; Author: CERN DEM JLC; CreateDate: 10.12.2013; LatestRevisionDate: 10.12.2013
C139 = CC0805_10UF_16V_10%_X5R: as C124 on sheet TH8_Breakout_cryo; Part Number: CC0805_10UF_16V_10%_X5R; Component Kind: Standard; Component Type: Standard; Pin Count: 2; Value: 10uF; Status: Preferred; Manufacturer Part Number: CC0805_10UF_16V_10%_X5R; Case: 0805; Mounted: Yes; Socket: No; SMD: Yes; Manufacturer1 Example: KEMET; Manufacturer1 ComponentHeight: 1.4mm; HelpURL: \\cern.ch\dfs\Applications\Altium\Datasheets\CC1206_X5R_KEMET.pdf; Author: CERN DEM JLC; CreateDate: 03.12.2007; LatestRevisionDate: 03.12.2007; Sense: No
C151 = CC0603_1UF_25V_10%_X7R: as C125 on sheet TH8_Breakout_cryo; Part Number: CC0603_1UF_25V_10%_X7R; Component Kind: Standard; Component Type: Standard; Pin Count: 2; Value: 1uF; Status: None; Manufacturer Part Number: CC0603_1UF_25V_10%_X7R; Case: 0603; Mounted: Yes; Socket: No; SMD: Yes; Sense: No; Manufacturer1 Example: MURATA; Manufacturer1 ComponentHeight: 0.9mm; HelpURL: \\cern.ch\dfs\Applications\Altium\Datasheets\CC0603_X7R_MURATA.pdf; Author: CERN DEM JLC; CreateDate: 18/01/2011; LatestRevisionDate: 18/01/2011
D36 = D_TVS_DRTR5V0U4S-7: as D35 on sheet TH8_Breakout_cryo; Part Number: DRTR5V0U4S-7; Component Kind: Standard; Component Type: Standard; Device: DRTR5V0U4S-7; PackageDescription: SOT363, SC70-6, 0.65mm Pitch; 6 Pin, 1.25mm W X 2.00mm L X 1.10mm H body, IPC Medium Density; Status: Active; Manufacturer Part Number: DRTR5V0U4S-7; Pin Count: 6; Case: SOT363; Mounted: Yes; Socket: No; SMD: Yes; Sense: No; ComponentHeight: 1.1mm; HelpURL: \\cern.ch\dfs\Applications\Altium\Datasheets\PRTR5V0U4Y.pdf; Author: GK; CreateDate: 24.01.2017; LatestRevisionDate: 14.09.2020
IC28 = 24AA02E48T-I/OT: as IC20 on sheet TH8_Breakout_cryo; Part Number: 24AA02E48T-I/OT; Component Kind: Standard; Component Type: Standard; Device: 24AA02E48T-I/OT; PackageDescription: SOT, 0.95mm pitch; 5 pin, 1.60mm W X 2.90mm L X 1.45mm H body, IPC Medium Density; Part Description: 1.7V-5.5V, 2K I2C Serial EEPROM With EUI-48 Node Identity; Manufacturer Part Number: 24AA02E48T-I/OT; Pin Count: 5; Case: SOT23-5; Mounted: Yes; Socket: No; SMD: Yes; Sense: No; ComponentHeight: 1.45mm; HelpURL: \\cern.ch\dfs\Applications\Altium\Datasheets\24AA02E48T-I-OT.pdf; Author: CERN DEM MR; CreateDate: 31.03.2016; LatestRevisionDate: 31.03.2016
IC33 = ADP150AUJZ-3.3-R7: as IC21 on sheet TH8_Breakout_cryo; Part Number: ADP150AUJZ-3.3-R7; Component Kind: Standard; Component Type: Standard; Device: ADP150AUJZ-3.3-R7; PackageDescription: SOT23, 0.95mm pitch; 5 pin, 1.75mm W X 3.00mm L, IPC Medium Density; Manufacturer Part Number: ADP150AUJZ-3.3-R7; Pin Count: 5; Case: SOT23; Mounted: Yes; Socket: No; SMD: Yes; Sense: No; ComponentHeight: 0.9mm; HelpURL: \\cern.ch\dfs\Applications\Altium\Datasheets\ADP150AUJZ-3.3-R7.pdf; Author: CERN DEM JLC; CreateDate: 27/09/2011; LatestRevisionDate: 19/06/2014
J7 J8 J11 J13 = 691382000008: WR-TBL Serie 382 Vertical PCB Header, Pluggable, pitch 2.5mm, 8p; Compliance: RoHS; Modularity: No; Pin Number: 8; Rated Current [UL]: 12A; Working Voltage [UL]: 300VAC; ComponentLink1Description: Manufacturer; ComponentLink1URL: http://www.we-online.de; ComponentLink2URL: https://katalog.we-online.de/em/datasheet/691382000008.pdf; ComponentLink2Description: Datasheet; Mounting Technology: THT; Part Number: 691382000008; Packaging: Box; Operating Temperature: -40 to +105degC; PCB/Cable/Panel: PCB; Pitch: 2.5mm; Published Date: October 2019; Type: Vertical; Publisher: Wurth Elektronik; Application: Pluggable
J17 J18 J28 J29 = CON_TB_WURTH_691381000008: as J1 on sheet TH8_Breakout_cryo; Manufacturer Part Number: 691381000008
J30 = AMPHENOL_10090926-P444XLF: as J15 on sheet TH8_Breakout_cryo; Part Number: AMPHENOL_10090926-P444XLF; Component Kind: Standard; Component Type: Standard; Pin Count: 46; Family: D-Sub; Mounted: Yes; Socket: No; SMD: No; Sense: No; Status: None; Manufacturer: AMPHENOL; Manufacturer Part Number: 10090926-P444XLF; ComponentHeight: 12.8mm; HelpURL: \\cern.ch\dfs\Applications\Altium\Datasheets\AMPHENOL_10090926-P444XLF.pdf; Author: CERN DEM BC; CreateDate: 22.10.2020; LatestRevisionDate: 22.10.2020
J31 J33 = PHOENIX_1803604: as J19 on sheet TH8_Breakout_cryo; Manufacturer: Phoenix Contact
J32 J34 = PHOENIX_1803455: as J14 on sheet TH8_Breakout_cryo; Part Number: PHOENIX_1803455; Component Kind: Standard; Component Type: Standard; Pin Count: 5; Mounted: Yes; Socket: No; SMD: No; Sense: No; Status: None; ComponentHeight: 9.2mm; HelpURL: \\cern.ch\dfs\Applications\Altium\Datasheets\PHOENIX_1803455.pdf; Author: CERN DEM JLC; CreateDate: 04.11.2013; LatestRevisionDate: 04.11.2013
L10-L13 = IND0402_MURATA_BLM15HB221SN1: Part Description: SMD EMIFIL Suppression Chip Ferrite Bead; Manufacturer: MURATA; Power: 250mA; Resistance: 1R; Tolerance: ±25%; Part Number: IND0402_MURATA_BLM15HB221SN1; Component Kind: Standard; Component Type: Standard; Pin Count: 2; Value: 220R@100MHz; Status: None; Manufacturer Part Number: BLM15HB221SN1; Case: 0402; Mounted: Yes; Socket: No; SMD: Yes; Sense: No; ComponentHeight: 0.55mm; HelpURL: \\cern.ch\dfs\Applications\Altium\Datasheets\IND0402_MURATA_BLM15H.pdf; Author: CERN DEM JLC; CreateDate: 23.06.2009; LatestRevisionDate: 25.10.2018
R155 R156 R161 R162 R166 R170 R180 R181 = R0603_0R_JUMPER: as R186 on sheet TH8_Breakout_cryo; Part Number: R0603_0R_JUMPER; Component Kind: Standard; Component Type: Standard; Pin Count: 2; Value: 0; Status: Preferred; Manufacturer Part Number: R0603_0R_JUMPER; Case: 0603; Mounted: Yes; Sense: No; Socket: No; SMD: Yes; Manufacturer1 Example: NIC COMPONENT; Manufacturer1 ComponentHeight: 0.55mm; HelpURL: \\cern.ch\dfs\Applications\Altium\Datasheets\R0603_NIC_NRC.pdf; Author: CERN DEM JLC; CreateDate: 03.12.2007; LatestRevisionDate: 13.03.2008
R157-R160 R163-R165 R167-R169 R171 R172 R176-R179 = R0805_5K_0.01%_0.2W_0.2PPM_VISHAY_VSMP: Resistor - 0.01%; Part Description: Ultra High Precision Foil Wraparound Surface Mount Chip Resistor; Manufacturer: VISHAY PRECISION; Manufacturer Part Number: Y16245K00000T9R; Power: 0.2W; TC: ±0.2ppm/°C; PressFit: No; Part Number: R0805_5K_0.01%_0.2W_0.2PPM_VISHAY_VSMP; Component Kind: Standard; Component Type: Standard; Pin Count: 2; Value: 5k; Status: None; Tolerance: ±0.01%; Case: 0805; Mounted: Yes; Sense: No; Socket: No; SMD: Yes; Manufacturer1 ComponentHeight: 0.64mm; HelpURL: \\cern.ch\dfs\Applications\Altium\Datasheets\R0805_VISHAY_VSMP.pdf; Author: CERN DEM JLC; CreateDate: 22.09.2011; LatestRevisionDate: 22.09.2011
R218 = R0402_33R_1%_0.0625W_100PPM: as R45 on sheet TH8_Breakout_cryo; Part Number: R0402_33R_1%_0.0625W_100PPM; Component Kind: Standard; Component Type: Standard; Pin Count: 2; Value: 33; Status: Not Recommended; Power: 0.0625W; Tolerance: ±1%; Manufacturer Part Number: R0402_33R_1%_0.0625W_100PPM; Case: 0402; Mounted: Yes; Sense: No; Socket: No; SMD: Yes; Manufacturer1 Example: YAGEO PHYCOMP; Manufacturer1 ComponentHeight: 0.4mm; HelpURL: \\cern.ch\dfs\Applications\Altium\Datasheets\R0402_Phycomp_RC0402.pdf; Author: CERN DEM JLC; CreateDate: 03/12/2007; LatestRevisionDate: 17/10/2012
TP4 TP5 TP15 = SMD_PAD_1.27X1.27MM: as TP12 on sheet TH8_Breakout_cryo; Part Number: SMD_PAD_1.27X1.27MM; Component Kind: Standard (No BOM); Component Type: Standard (No BOM); Pin Count: 1; Family: Test Point; Socket: No; SMD: Yes; Sense: No; Status: None; ComponentHeight: 0mm; HelpURL: Undefined; Author: CERN DEM JLC; CreateDate: 12.01.2008; LatestRevisionDate: 12.01.2008; PackageDescription: 1.27mm x 1.27mm PCB Copper Area (SMD Test Point)

## Nets that join several sheets
GND: TH8_Breakout_cryo (33 pins), TH8_Breakout (23 pins)

## Assembly variants
Default: not fitted C102 C103 C160 C161 IC15 IC23 IC36 IC39 IC40 IC41 J4 R44_1 R44_2 R44_3 R44_4 R50_1 R50_2 R50_3 R50_4 R91_1 R91_2 R91_3 R91_4 R126_1 R126_2 R126_3 R126_4 R127_1 R127_2 R127_3 R127_4 R129_1 R129_2 R129_3 R129_4 R130_1 R130_2 R130_3 R130_4 R132_1 R132_2 R132_3 R132_4 R221 R227 R229 R231 R232 R233 W2